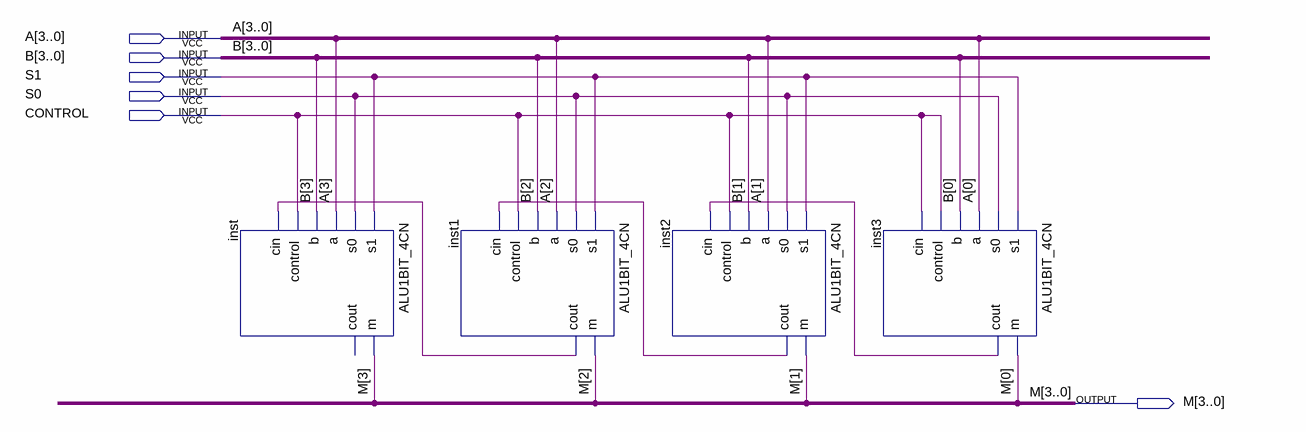
[diagram p0: schematic sheet]
// Quartus schematic ALU4BIT_4CN.bdf as structural Verilog: 4 symbols, 6 pins
module ALU4BIT_4CN (
  input  [3:0] A,
  input  [3:0] B,
  input  S1,
  input  S0,
  input  CONTROL,
  output [3:0] M
);

  wire inst1_cout, inst2_cout, inst3_cout;

  ALU1BIT_4CN inst (.s1(S1), .s0(S0), .a(A[3]), .b(B[3]), .control(CONTROL), .cin(inst1_cout), .m(M[3]));  // open: cout
  ALU1BIT_4CN inst1 (
    .s1(S1), .s0(S0), .a(A[2]), .b(B[2]), .control(CONTROL), .cin(inst2_cout), .m(M[2]), .cout(inst1_cout));
  ALU1BIT_4CN inst2 (
    .s1(S1), .s0(S0), .a(A[1]), .b(B[1]), .control(CONTROL), .cin(inst3_cout), .m(M[1]), .cout(inst2_cout));
  ALU1BIT_4CN inst3 (
    .s1(S1), .s0(S0), .a(A[0]), .b(B[0]), .control(CONTROL), .cin(CONTROL), .m(M[0]), .cout(inst3_cout));
endmodule
